# EAGLE design automaton (EAGLE 6.4)

## Sheet 1 of 8: Power
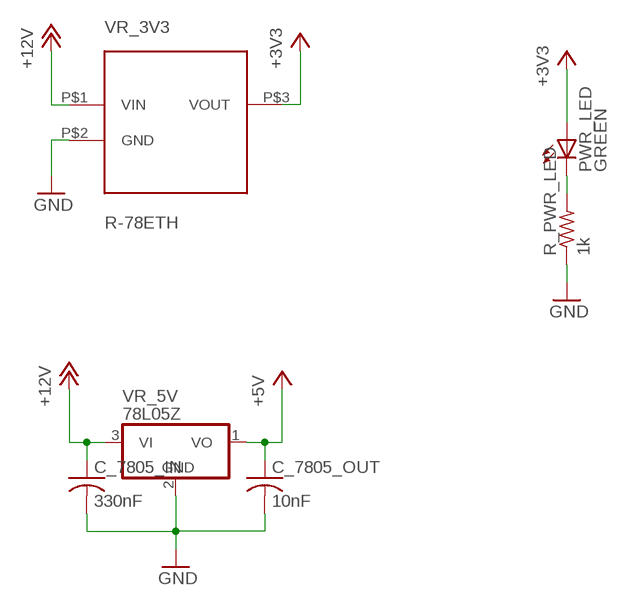
[diagram p0: schematic, sheet 1]

### Parts
C_7805_IN  330nF  C-USC1206  [C1206]
C_7805_OUT  10nF  C-USC1206  [C1206]
PWR_LED  GREEN  LEDCHIPLED_1206  [CHIPLED_1206]
R_PWR_LED  1k  R-US_R1206  [R1206]
VR_3V3  R-78ETH  [R-78E]
VR_5V  78L05Z  [TO92]

### Nets
+3V3 [3v3]: PWR_LED.A VR_3V3.P$3(VOUT) ; also sheet 2,3,4,5,6,7,8
+5V [5v]: C_7805_OUT.1 VR_5V.1(VO) ; also sheet 3
+12V [12v]: C_7805_IN.1 VR_3V3.P$1(VIN) VR_5V.3(VI) ; also sheet 3
GND [gnd]: C_7805_IN.2 C_7805_OUT.2 R_PWR_LED.1 VR_3V3.P$2(GND) VR_5V.2(GND) ; also sheet 2,3,4,5,6,7,8
N$24: PWR_LED.C R_PWR_LED.2

## Sheet 2 of 8: AVR
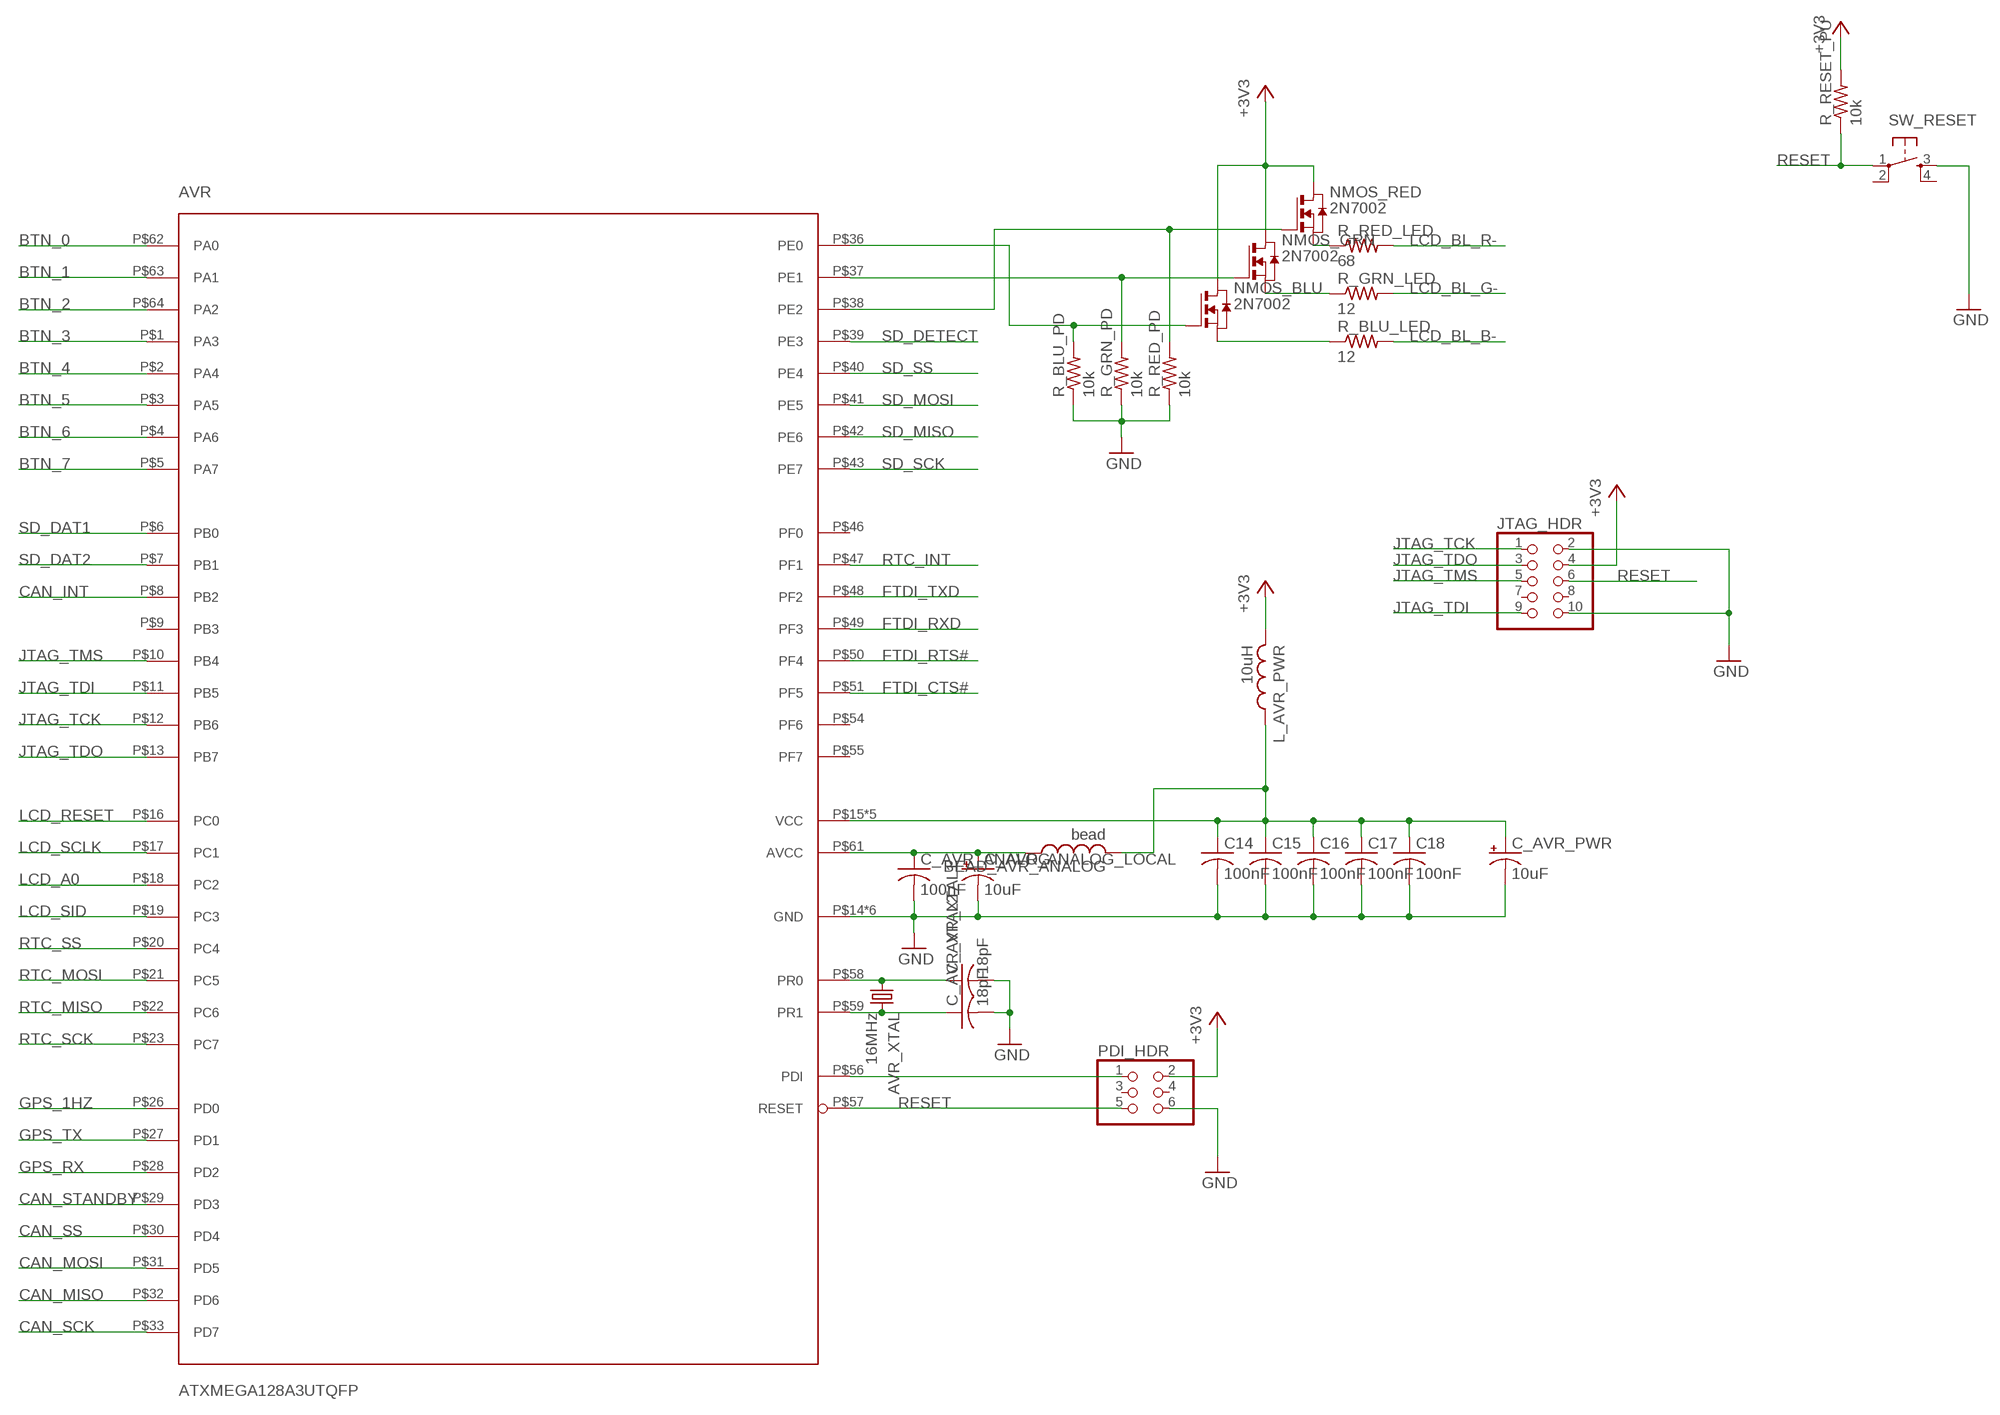
[diagram p1: schematic, sheet 2]

### Parts
AVR  ATXMEGA128A3UTQFP  [ATMEL_TQFP64]
AVR_XTAL  16MHz  CRYSTALHC49S  [HC49/S]
BEAD_AVR_ANALOG  bead  L-USL1812  [L1812]
C14  100nF  C-USC1206  [C1206]
C15  100nF  C-USC1206  [C1206]
C16  100nF  C-USC1206  [C1206]
C17  100nF  C-USC1206  [C1206]
C18  100nF  C-USC1206  [C1206]
C_AVR_ANALOG  100nF  C-USC1206  [C1206]
C_AVR_ANALOG_LOCAL  10uF  CPOL-USE2-5  [E2-5]
C_AVR_PWR  10uF  CPOL-USE2-5  [E2-5]
C_AVR_XTAL1  18pF  C-USC1206  [C1206]
C_AVR_XTAL2  18pF  C-USC1206  [C1206]
JTAG_HDR  PINHD-2X05_2.54  [2X05]
L_AVR_PWR  10uH  L-USL1812  [L1812]
NMOS_BLU  2N7002  NMOSSOT23  [SOT-23]
NMOS_GRN  2N7002  NMOSSOT23  [SOT-23]
NMOS_RED  2N7002  NMOSSOT23  [SOT-23]
PDI_HDR  PINHD-2X03_2.54  [2X03]
R_BLU_LED  12  R-US_R1206  [R1206]
R_BLU_PD  10k  R-US_R1206  [R1206]
R_GRN_LED  12  R-US_R1206  [R1206]
R_GRN_PD  10k  R-US_R1206  [R1206]
R_RED_LED  68  R-US_R1206  [R1206]
R_RED_PD  10k  R-US_R1206  [R1206]
R_RESET_PU  10k  R-US_R1206  [R1206]
SW_RESET  TAC_SWITCHSMD  [TACTILE_SWITCH_SMD]

### Nets
+3V3 [3v3]: JTAG_HDR.4 L_AVR_PWR.2 NMOS_BLU.1(D) NMOS_GRN.1(D) NMOS_RED.1(D) PDI_HDR.2 R_RESET_PU.2 ; also sheet 1,3,4,5,6,7,8
BTN_0: AVR.P$62(PA0) ; also sheet 6
BTN_1: AVR.P$63(PA1) ; also sheet 6
BTN_2: AVR.P$64(PA2) ; also sheet 6
BTN_3: AVR.P$1(PA3) ; also sheet 6
BTN_4: AVR.P$2(PA4) ; also sheet 6
BTN_5: AVR.P$3(PA5) ; also sheet 6
BTN_6: AVR.P$4(PA6) ; also sheet 6
BTN_7: AVR.P$5(PA7) ; also sheet 6
CAN_INT: AVR.P$8(PB2) ; also sheet 3
CAN_MISO: AVR.P$32(PD6) ; also sheet 3
CAN_MOSI: AVR.P$31(PD5) ; also sheet 3
CAN_SCK: AVR.P$33(PD7) ; also sheet 3
CAN_SS: AVR.P$30(PD4) ; also sheet 3
CAN_STANDBY: AVR.P$29(PD3) ; also sheet 3
FTDI_CTS#: AVR.P$51(PF5) ; also sheet 7
FTDI_RTS#: AVR.P$50(PF4) ; also sheet 7
FTDI_RXD: AVR.P$49(PF3) ; also sheet 7
FTDI_TXD: AVR.P$48(PF2) ; also sheet 7
GND [gnd]: AVR.P$14(GND) AVR.P$24(GND) AVR.P$34(GND) AVR.P$44(GND) AVR.P$52(GND) AVR.P$60(GND) C14.2 C15.2 C16.2 C17.2 C18.2 C_AVR_ANALOG.2 C_AVR_ANALOG_LOCAL.- C_AVR_PWR.- C_AVR_XTAL1.2 C_AVR_XTAL2.2 JTAG_HDR.2 JTAG_HDR.10 PDI_HDR.6 R_BLU_PD.1 R_GRN_PD.1 R_RED_PD.1 SW_RESET.3 ; also sheet 1,3,4,5,6,7,8
GPS_1HZ: AVR.P$26(PD0) ; also sheet 4
GPS_RX: AVR.P$28(PD2) ; also sheet 4
GPS_TX: AVR.P$27(PD1) ; also sheet 4
JTAG_TCK: AVR.P$12(PB6) JTAG_HDR.1
JTAG_TDI: AVR.P$11(PB5) JTAG_HDR.9
JTAG_TDO: AVR.P$13(PB7) JTAG_HDR.3
JTAG_TMS: AVR.P$10(PB4) JTAG_HDR.5
LCD_A0: AVR.P$18(PC2) ; also sheet 6
LCD_BL_B-: R_BLU_LED.2 ; also sheet 6
LCD_BL_G-: R_GRN_LED.2 ; also sheet 6
LCD_BL_R-: R_RED_LED.2 ; also sheet 6
LCD_RESET: AVR.P$16(PC0) ; also sheet 6
LCD_SCLK: AVR.P$17(PC1) ; also sheet 6
LCD_SID: AVR.P$19(PC3) ; also sheet 6
N$6: AVR.P$58(PR0) AVR_XTAL.1 C_AVR_XTAL1.1
N$7: AVR.P$59(PR1) AVR_XTAL.2 C_AVR_XTAL2.1
N$18: AVR.P$37(PE1) NMOS_GRN.3(G) R_GRN_PD.2
N$19: AVR.P$36(PE0) NMOS_BLU.3(G) R_BLU_PD.2
N$23 [3v3]: AVR.P$61(AVCC) BEAD_AVR_ANALOG.1 C_AVR_ANALOG.1 C_AVR_ANALOG_LOCAL.+
N$27: AVR.P$38(PE2) NMOS_RED.3(G) R_RED_PD.2
N$28 [3v3]: AVR.P$15(VCC) AVR.P$25(VCC) AVR.P$35(VCC) AVR.P$45(VCC) AVR.P$53(VCC) BEAD_AVR_ANALOG.2 C14.1 C15.1 C16.1 C17.1 C18.1 C_AVR_PWR.+ L_AVR_PWR.1
N$29: NMOS_BLU.2(S) R_BLU_LED.1
N$30: NMOS_GRN.2(S) R_GRN_LED.1
N$31: NMOS_RED.2(S) R_RED_LED.1
PDI_DATA: AVR.P$56(PDI) PDI_HDR.1
RESET: AVR.P$57(RESET) JTAG_HDR.6 PDI_HDR.5 R_RESET_PU.1 SW_RESET.1
RTC_INT: AVR.P$47(PF1) ; also sheet 5
RTC_MISO: AVR.P$22(PC6) ; also sheet 5
RTC_MOSI: AVR.P$21(PC5) ; also sheet 5
RTC_SCK: AVR.P$23(PC7) ; also sheet 5
RTC_SS: AVR.P$20(PC4) ; also sheet 5
SD_DAT1: AVR.P$6(PB0) ; also sheet 8
SD_DAT2: AVR.P$7(PB1) ; also sheet 8
SD_DETECT: AVR.P$39(PE3) ; also sheet 8
SD_MISO: AVR.P$42(PE6) ; also sheet 8
SD_MOSI: AVR.P$41(PE5) ; also sheet 8
SD_SCK: AVR.P$43(PE7) ; also sheet 8
SD_SS: AVR.P$40(PE4) ; also sheet 8
Unconnected: AVR.P$9(PB3) AVR.P$46(PF0) AVR.P$54(PF6) AVR.P$55(PF7) JTAG_HDR.7 JTAG_HDR.8 PDI_HDR.3 PDI_HDR.4 SW_RESET.2 SW_RESET.4

## Sheet 3 of 8: CAN
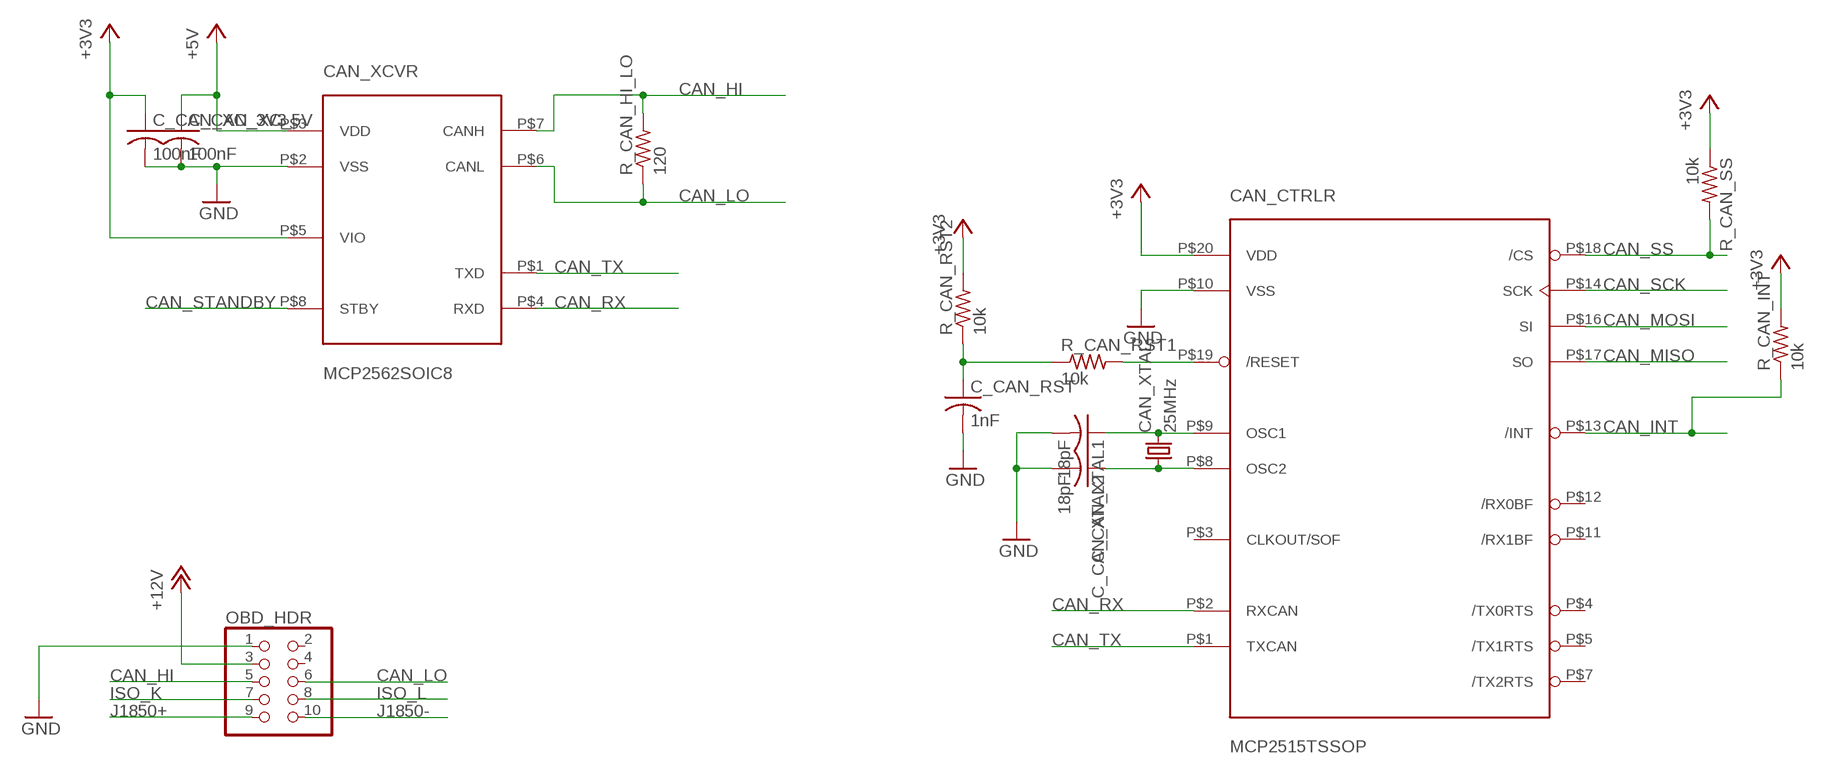
[diagram p2: schematic, sheet 3]

### Parts
C_CAN_RST  1nF  C-USC1206  [C1206]
C_CAN_XC_3V3  100nF  C-USC1206  [C1206]
C_CAN_XC_5V  100nF  C-USC1206  [C1206]
C_CAN_XTAL1  18pF  C-USC1206  [C1206]
C_CAN_XTAL2  18pF  C-USC1206  [C1206]
CAN_CTRLR  MCP2515TSSOP  [MICROCHIP_TSSOP20]
CAN_XCVR  MCP2562SOIC8  [MICROCHIP_SOIC8]
CAN_XTAL  25MHz  CRYSTALHC49S  [HC49/S]
OBD_HDR  PINHD-2X05_2.54-90°  [2X05/90]
R_CAN_HI_LO  120  R-US_R1206  [R1206]
R_CAN_INT  10k  R-US_R1206  [R1206]
R_CAN_RST1  10k  R-US_R1206  [R1206]
R_CAN_RST2  10k  R-US_R1206  [R1206]
R_CAN_SS  10k  R-US_R1206  [R1206]

### Nets
+3V3 [3v3]: C_CAN_XC_3V3.1 CAN_CTRLR.P$20(VDD) CAN_XCVR.P$5(VIO) R_CAN_INT.2 R_CAN_RST2.2 R_CAN_SS.1 ; also sheet 1,2,4,5,6,7,8
+5V [5v]: C_CAN_XC_5V.1 CAN_XCVR.P$3(VDD) ; also sheet 1
+12V [12v]: OBD_HDR.3 ; also sheet 1
CAN_HI: CAN_XCVR.P$7(CANH) OBD_HDR.5 R_CAN_HI_LO.2
CAN_INT: CAN_CTRLR.P$13(/INT) R_CAN_INT.1 ; also sheet 2
CAN_LO: CAN_XCVR.P$6(CANL) OBD_HDR.6 R_CAN_HI_LO.1
CAN_MISO: CAN_CTRLR.P$17(SO) ; also sheet 2
CAN_MOSI: CAN_CTRLR.P$16(SI) ; also sheet 2
CAN_RX: CAN_CTRLR.P$2(RXCAN) CAN_XCVR.P$4(RXD)
CAN_SCK: CAN_CTRLR.P$14(SCK) ; also sheet 2
CAN_SS: CAN_CTRLR.P$18(/CS) R_CAN_SS.2 ; also sheet 2
CAN_STANDBY: CAN_XCVR.P$8(STBY) ; also sheet 2
CAN_TX: CAN_CTRLR.P$1(TXCAN) CAN_XCVR.P$1(TXD)
GND [gnd]: C_CAN_RST.2 C_CAN_XC_3V3.2 C_CAN_XC_5V.2 C_CAN_XTAL1.2 C_CAN_XTAL2.2 CAN_CTRLR.P$10(VSS) CAN_XCVR.P$2(VSS) OBD_HDR.1 ; also sheet 1,2,4,5,6,7,8
ISO_K: OBD_HDR.7
ISO_L: OBD_HDR.8
J1850+: OBD_HDR.9
J1850-: OBD_HDR.10
N$5: C_CAN_RST.1 R_CAN_RST1.1 R_CAN_RST2.1
N$20: C_CAN_XTAL1.1 CAN_CTRLR.P$9(OSC1) CAN_XTAL.2
N$21: C_CAN_XTAL2.1 CAN_CTRLR.P$8(OSC2) CAN_XTAL.1
N$22: CAN_CTRLR.P$19(/RESET) R_CAN_RST1.2
Unconnected: CAN_CTRLR.P$3(CLKOUT/SOF) CAN_CTRLR.P$4(/TX0RTS) CAN_CTRLR.P$5(/TX1RTS) CAN_CTRLR.P$7(/TX2RTS) CAN_CTRLR.P$11(/RX1BF) CAN_CTRLR.P$12(/RX0BF) OBD_HDR.2 OBD_HDR.4

## Sheet 4 of 8: GPS
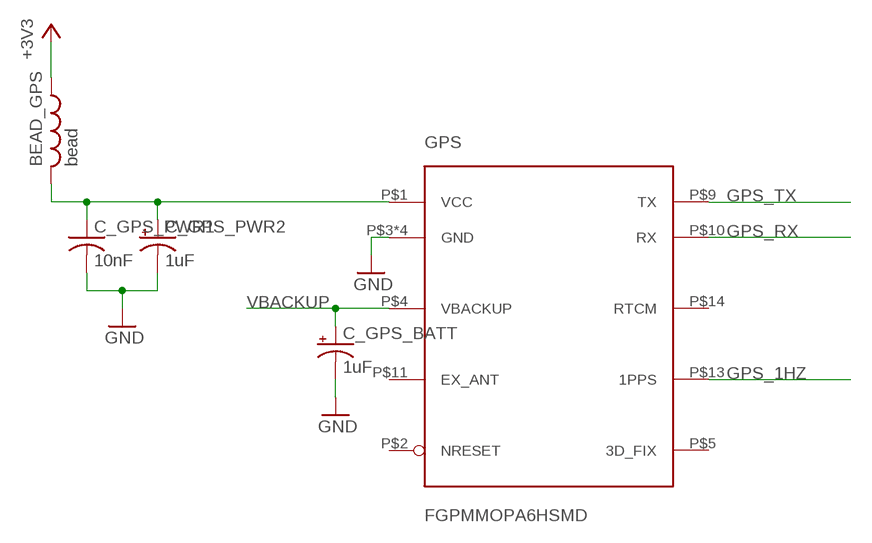
[diagram p3: schematic, sheet 4]

### Parts
BEAD_GPS  bead  L-USL1812  [L1812]
C_GPS_BATT  1uF  CPOL-USE2-5  [E2-5]
C_GPS_PWR1  10nF  C-USC1206  [C1206]
C_GPS_PWR2  1uF  CPOL-USE2-5  [E2-5]
GPS  FGPMMOPA6HSMD  [FGPMMOPA6H]

### Nets
+3V3 [3v3]: BEAD_GPS.1 ; also sheet 1,2,3,5,6,7,8
GND [gnd]: C_GPS_BATT.- C_GPS_PWR1.2 C_GPS_PWR2.- GPS.P$3(GND) GPS.P$8(GND) GPS.P$12(GND) GPS.P$19(GND) ; also sheet 1,2,3,5,6,7,8
GPS_1HZ: GPS.P$13(1PPS) ; also sheet 2
GPS_RX: GPS.P$10(RX) ; also sheet 2
GPS_TX: GPS.P$9(TX) ; also sheet 2
N$1 [3v3]: BEAD_GPS.2 C_GPS_PWR1.1 C_GPS_PWR2.+ GPS.P$1(VCC)
VBACKUP [vbatt]: C_GPS_BATT.+ GPS.P$4(VBACKUP) ; also sheet 5
Unconnected: GPS.P$2(NRESET) GPS.P$5(3D_FIX) GPS.P$11(EX_ANT) GPS.P$14(RTCM)

## Sheet 5 of 8: RTC
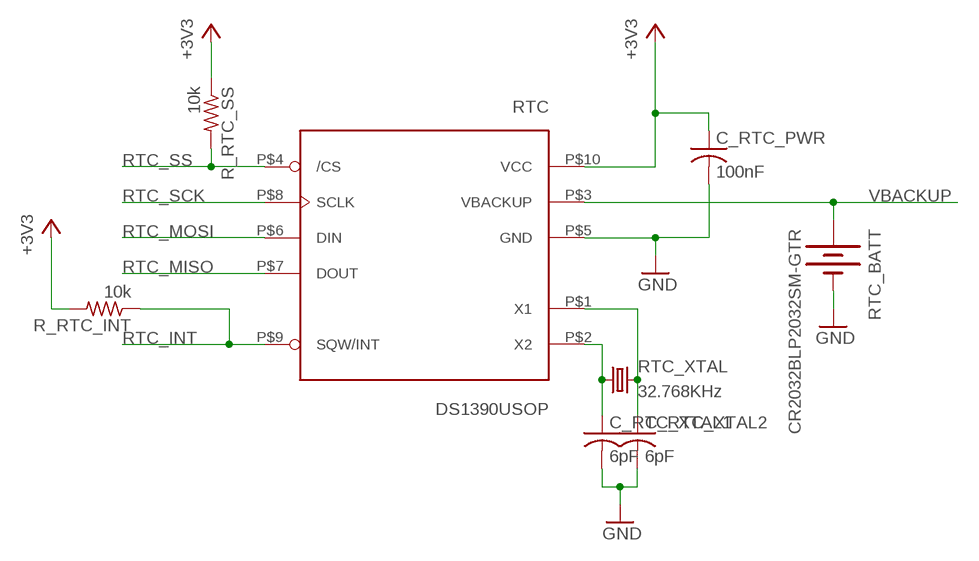
[diagram p4: schematic, sheet 5]

### Parts
C_RTC_PWR  100nF  C-USC1206  [C1206]
C_RTC_XTAL1  6pF  C-USC1206  [C1206]
C_RTC_XTAL2  6pF  C-USC1206  [C1206]
R_RTC_INT  10k  R-US_R1206  [R1206]
R_RTC_SS  10k  R-US_R1206  [R1206]
RTC  DS1390USOP  [MAXIM_10USOP]
RTC_BATT  CR2032BLP2032SM-GTR  [BLP2032SM-GTR]
RTC_XTAL  32.768KHz  CRYSTALTC26V  [TC26V]

### Nets
+3V3 [3v3]: C_RTC_PWR.1 R_RTC_INT.2 R_RTC_SS.1 RTC.P$10(VCC) ; also sheet 1,2,3,4,6,7,8
GND [gnd]: C_RTC_PWR.2 C_RTC_XTAL1.2 C_RTC_XTAL2.2 RTC.P$5(GND) RTC_BATT.P$2(-) ; also sheet 1,2,3,4,6,7,8
N$2: C_RTC_XTAL1.1 RTC.P$2(X2) RTC_XTAL.1
N$3: C_RTC_XTAL2.1 RTC.P$1(X1) RTC_XTAL.2
RTC_INT: R_RTC_INT.1 RTC.P$9(SQW/INT) ; also sheet 2
RTC_MISO: RTC.P$7(DOUT) ; also sheet 2
RTC_MOSI: RTC.P$6(DIN) ; also sheet 2
RTC_SCK: RTC.P$8(SCLK) ; also sheet 2
RTC_SS: R_RTC_SS.2 RTC.P$4(/CS) ; also sheet 2
VBACKUP [vbatt]: RTC.P$3(VBACKUP) RTC_BATT.P$1(+) ; also sheet 4

## Sheet 6 of 8: Front Panel
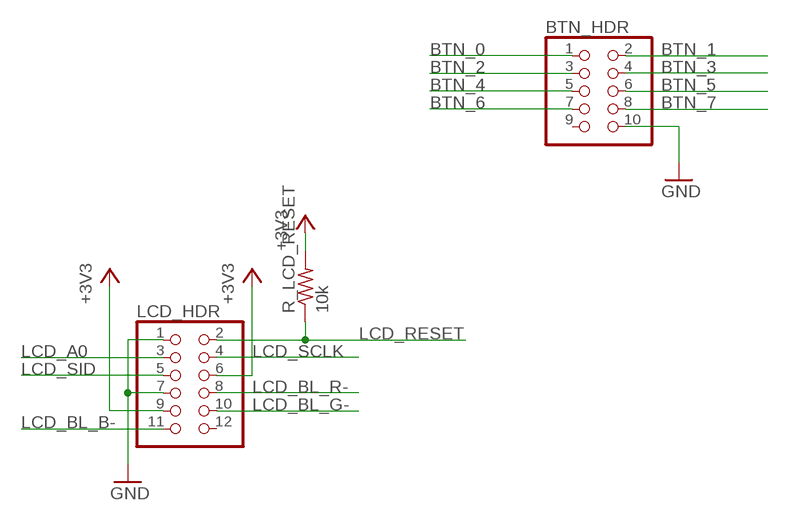
[diagram p5: schematic, sheet 6]

### Parts
BTN_HDR  PINHD-2X05_2.54  [2X05]
LCD_HDR  PINHD-2X06_2.54  [2X06]
R_LCD_RESET  10k  R-US_R1206  [R1206]

### Nets
+3V3 [3v3]: LCD_HDR.6 LCD_HDR.9 R_LCD_RESET.2 ; also sheet 1,2,3,4,5,7,8
BTN_0: BTN_HDR.1 ; also sheet 2
BTN_1: BTN_HDR.2 ; also sheet 2
BTN_2: BTN_HDR.3 ; also sheet 2
BTN_3: BTN_HDR.4 ; also sheet 2
BTN_4: BTN_HDR.5 ; also sheet 2
BTN_5: BTN_HDR.6 ; also sheet 2
BTN_6: BTN_HDR.7 ; also sheet 2
BTN_7: BTN_HDR.8 ; also sheet 2
GND [gnd]: BTN_HDR.10 LCD_HDR.1 LCD_HDR.7 ; also sheet 1,2,3,4,5,7,8
LCD_A0: LCD_HDR.3 ; also sheet 2
LCD_BL_B-: LCD_HDR.11 ; also sheet 2
LCD_BL_G-: LCD_HDR.10 ; also sheet 2
LCD_BL_R-: LCD_HDR.8 ; also sheet 2
LCD_RESET: LCD_HDR.2 R_LCD_RESET.1 ; also sheet 2
LCD_SCLK: LCD_HDR.4 ; also sheet 2
LCD_SID: LCD_HDR.5 ; also sheet 2
Unconnected: BTN_HDR.9 LCD_HDR.12

## Sheet 7 of 8: USB
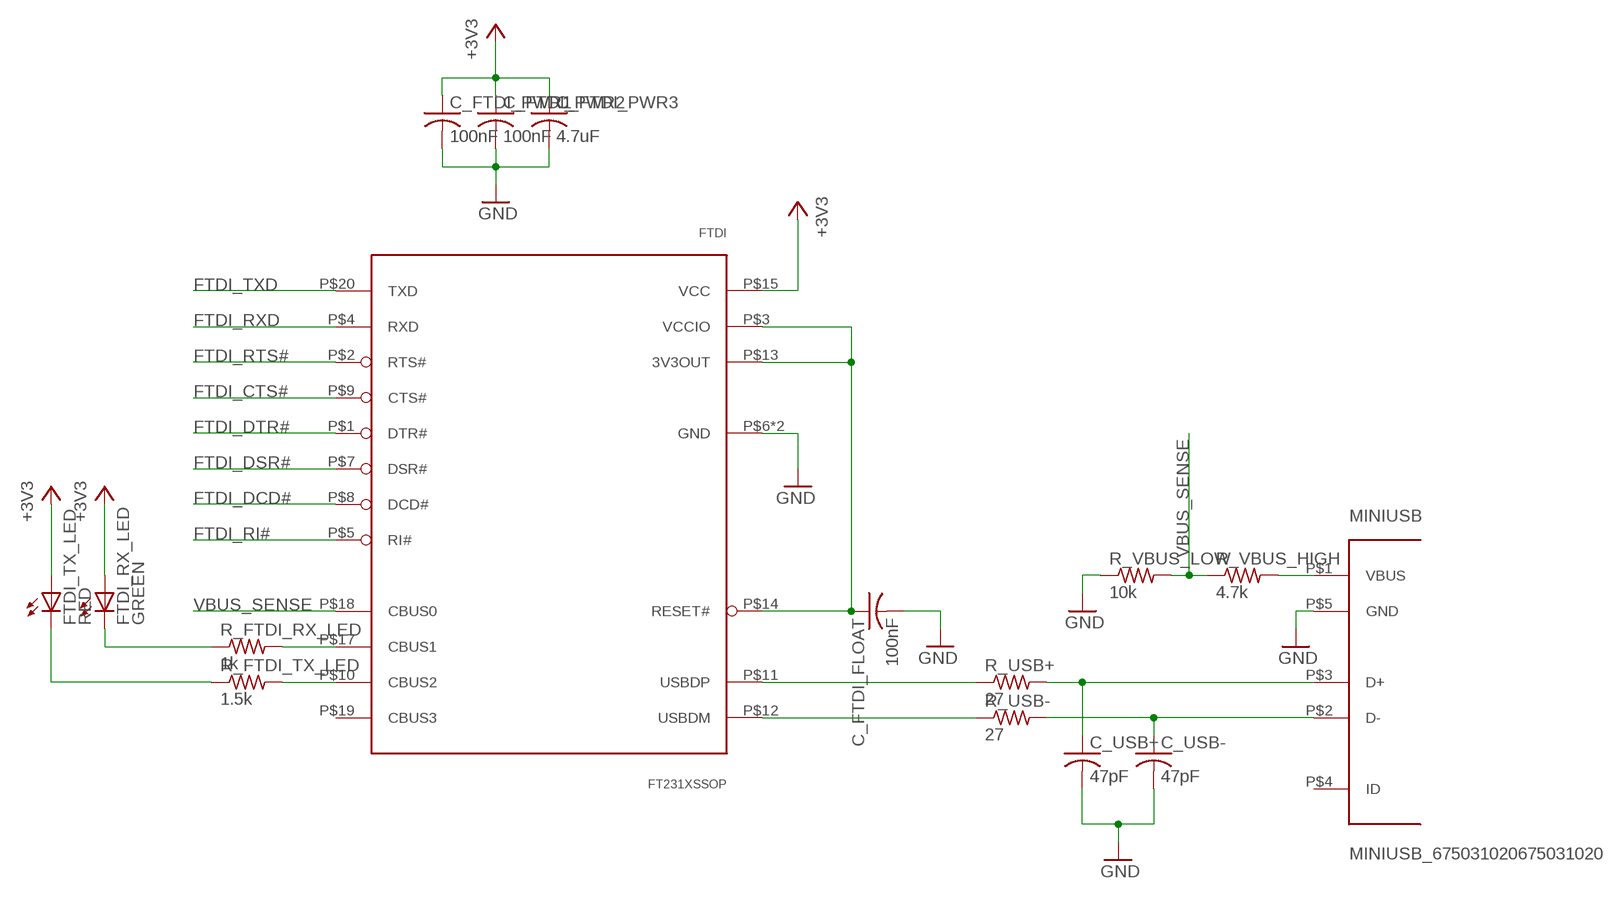
[diagram p6: schematic, sheet 7]

### Parts
C_FTDI_FLOAT  100nF  C-USC1206  [C1206]
C_FTDI_PWR1  100nF  C-USC1206  [C1206]
C_FTDI_PWR2  100nF  C-USC1206  [C1206]
C_FTDI_PWR3  4.7uF  C-USC1206  [C1206]
C_USB+  47pF  C-USC1206  [C1206]
C_USB-  47pF  C-USC1206  [C1206]
FTDI  FT231XSSOP  [FTDI_SSOP20]
FTDI_RX_LED  GREEN  LEDCHIPLED_1206  [CHIPLED_1206]
FTDI_TX_LED  RED  LEDCHIPLED_1206  [CHIPLED_1206]
MINIUSB  MINIUSB_675031020675031020  [MINIUSB_675031020]
R_FTDI_RX_LED  1k  R-US_R1206  [R1206]
R_FTDI_TX_LED  1.5k  R-US_R1206  [R1206]
R_USB+  27  R-US_R1206  [R1206]
R_USB-  27  R-US_R1206  [R1206]
R_VBUS_HIGH  4.7k  R-US_R1206  [R1206]
R_VBUS_LOW  10k  R-US_R1206  [R1206]

### Nets
+3V3 [3v3]: C_FTDI_PWR1.1 C_FTDI_PWR2.1 C_FTDI_PWR3.1 FTDI.P$15(VCC) FTDI_RX_LED.A FTDI_TX_LED.A ; also sheet 1,2,3,4,5,6,8
FTDI_CTS#: FTDI.P$9(CTS#) ; also sheet 2
FTDI_DCD#: FTDI.P$8(DCD#)
FTDI_DSR#: FTDI.P$7(DSR#)
FTDI_DTR#: FTDI.P$1(DTR#)
FTDI_RI#: FTDI.P$5(RI#)
FTDI_RTS#: FTDI.P$2(RTS#) ; also sheet 2
FTDI_RXD: FTDI.P$4(RXD) ; also sheet 2
FTDI_TXD: FTDI.P$20(TXD) ; also sheet 2
GND [gnd]: C_FTDI_FLOAT.2 C_FTDI_PWR1.2 C_FTDI_PWR2.2 C_FTDI_PWR3.2 C_USB+.2 C_USB-.2 FTDI.P$6(GND) FTDI.P$16(GND) MINIUSB.P$5(GND) R_VBUS_LOW.1 ; also sheet 1,2,3,4,5,6,8
N$4: C_FTDI_FLOAT.1 FTDI.P$3(VCCIO) FTDI.P$13(3V3OUT) FTDI.P$14(RESET#)
N$8: FTDI_RX_LED.C R_FTDI_RX_LED.1
N$9: FTDI.P$12(USBDM) R_USB-.1
N$10: FTDI.P$11(USBDP) R_USB+.1
N$11: FTDI_TX_LED.C R_FTDI_TX_LED.1
N$12: FTDI.P$10(CBUS2) R_FTDI_TX_LED.2
N$13: FTDI.P$17(CBUS1) R_FTDI_RX_LED.2
N$14: C_USB+.1 MINIUSB.P$3(D+) R_USB+.2
N$15: C_USB-.1 MINIUSB.P$2(D-) R_USB-.2
N$17: MINIUSB.P$1(VBUS) R_VBUS_HIGH.2
VBUS_SENSE: FTDI.P$18(CBUS0) R_VBUS_HIGH.1 R_VBUS_LOW.2
Unconnected: FTDI.P$19(CBUS3) MINIUSB.P$4(ID)

## Sheet 8 of 8: MicroSD
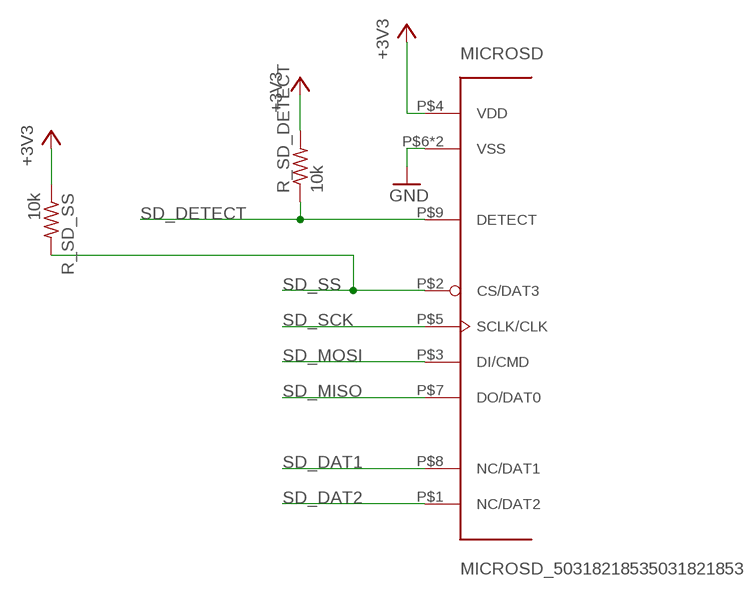
[diagram p7: schematic, sheet 8]

### Parts
MICROSD  MICROSD_50318218535031821853  [MICROSD_5031821853]
R_SD_DETECT  10k  R-US_R1206  [R1206]
R_SD_SS  10k  R-US_R1206  [R1206]

### Nets
+3V3 [3v3]: MICROSD.P$4(VDD) R_SD_DETECT.2 R_SD_SS.1 ; also sheet 1,2,3,4,5,6,7
GND [gnd]: MICROSD.P$6(VSS) MICROSD.P$10(VSS) ; also sheet 1,2,3,4,5,6,7
SD_DAT1: MICROSD.P$8(NC/DAT1) ; also sheet 2
SD_DAT2: MICROSD.P$1(NC/DAT2) ; also sheet 2
SD_DETECT: MICROSD.P$9(DETECT) R_SD_DETECT.1 ; also sheet 2
SD_MISO: MICROSD.P$7(DO/DAT0) ; also sheet 2
SD_MOSI: MICROSD.P$3(DI/CMD) ; also sheet 2
SD_SCK: MICROSD.P$5(SCLK/CLK) ; also sheet 2
SD_SS: MICROSD.P$2(CS/DAT3) R_SD_SS.2 ; also sheet 2

## Library data of the parts
AVR = automaton:ATXMEGA128A3U
AVR_XTAL CAN_XTAL = crystal:CRYSTAL: CRYSTAL; OC_FARNELL: 1667008; OC_NEWARK: unknown
BEAD_AVR_ANALOG BEAD_GPS L_AVR_PWR = rcl:L-US: INDUCTOR, American symbol
BTN_HDR JTAG_HDR OBD_HDR = pinhead-2:PINHD-2X05: PIN HEADER
C14-C18 C_7805_IN C_7805_OUT C_AVR_ANALOG C_AVR_XTAL1 C_AVR_XTAL2 C_CAN_RST C_CAN_XC_3V3 C_CAN_XC_5V C_CAN_XTAL1 C_CAN_XTAL2 C_FTDI_FLOAT C_FTDI_PWR1-C_FTDI_PWR3 C_GPS_PWR1 C_RTC_PWR C_RTC_XTAL1 C_RTC_XTAL2 C_USB+ C_USB- = rcl:C-US: CAPACITOR, American symbol
C_AVR_ANALOG_LOCAL C_AVR_PWR C_GPS_BATT C_GPS_PWR2 = rcl:CPOL-US: POLARIZED CAPACITOR, American symbol
CAN_CTRLR = automaton:MCP2515
CAN_XCVR = automaton:MCP2562
FTDI = automaton:FT231X
FTDI_RX_LED FTDI_TX_LED PWR_LED = led:LED: LED OSRAM: - CHIPLED LG R971, LG N971, LY N971, LG Q971, LY Q971, LO R971, LY R971 LH N974, LH R974 LS Q976, LO Q976, LY Q976 LO Q996 - Hyper CHIPLED LW Q18S LB Q993, LB Q99A, LB R99A - SideLED LS A670, LO A670, LY A670, LG A670, LP A670 LB A673, LV A673, LT A673, LW A673 LH A674 LY A675 LS A676, LA A676, LO A676, LY A676, LW A676 LS A679, LY A679, LG A679 - Hyper Micro SIDELED® LS Y876, LA Y876, LO Y876, LY Y876 LT Y87S - SmartLED LW L88C, LW L88S LB L89C, LB L89S, LG L890 LS L89K, LO L89K, LY L89K LS L896, LA L896, LO L896, LY L896 - TOPLED LS T670, LO T670, LY T670, LG T670, LP T670 LSG T670, LSP T670, LSY T670, LOP T670, LYG T670 LG T671, LOG T671, LSG T671 LB T673, LV T673, LT T673, LW T673 LH T674 LS T676, LA T676, LO T676, LY T676, LB T676, LH T676, LSB T676, LW T676 LB T67C, LV T67C, LT T67C, LS T67K, LO T67K, LY T67K, LW E67C LS E67B, LA E67B, LO E67B, LY E67B, LB E67C, LV E67C, LT E67C LW T67C LS T679, LY T679, LG T679 LS T770, LO T770, LY T770, LG T770, LP T770 LB T773, LV T773, LT T773, LW T773 LH T774 LS E675, LA E675, LY E675, LS T675 LS T776, LA T776, LO T776, LY T776, LB T776 LHGB T686 LT T68C, LB T68C - Hyper Mini TOPLED® LB M676 - Mini TOPLED Santana® LG M470 LS M47K, LO M47K, LY M47K Source: http://www.osram.convergy.de LUXEON: - LUMILED® LXK2-PW12-R00, LXK2-PW12-S00, LXK2-PW14-U00, LXK2-PW14-V00 LXK2-PM12-R00, LXK2-PM12-S00, LXK2-PM14-U00 LXK2-PE12-Q00, LXK2-PE12-R00, LXK2-PE12-S00, LXK2-PE14-T00, LXK2-PE14-U00 LXK2-PB12-K00, LXK2-PB12-L00, LXK2-PB12-M00, LXK2-PB14-N00, LXK2-PB14-P00, LXK2-PB14-Q00 LXK2-PR12-L00, LXK2-PR12-M00, LXK2-PR14-Q00, LXK2-PR14-R00 LXK2-PD12-Q00, LXK2-PD12-R00, LXK2-PD12-S00 LXK2-PH12-R00, LXK2-PH12-S00 LXK2-PL12-P00, LXK2-PL12-Q00, LXK2-PL12-R00 Source: www.luxeon.com KINGBRIGHT: KA-3528ASYC Source: www.kingbright.com
GPS = automaton:FGPMMOPA6H
LCD_HDR = pinhead-2:PINHD-2X06: PIN HEADER
MICROSD = automaton:MICROSD_5031821853
MINIUSB = automaton:MINIUSB_675031020
NMOS_BLU NMOS_GRN NMOS_RED = zetex:NMOSSOT23: MOS FET; OC_FARNELL: unknown; OC_NEWARK: unknown
PDI_HDR = pinhead-2:PINHD-2X03: PIN HEADER
R_BLU_LED R_BLU_PD R_CAN_HI_LO R_CAN_INT R_CAN_RST1 R_CAN_RST2 R_CAN_SS R_FTDI_RX_LED R_FTDI_TX_LED R_GRN_LED R_GRN_PD R_LCD_RESET R_PWR_LED R_RED_LED R_RED_PD R_RESET_PU R_RTC_INT R_RTC_SS R_SD_DETECT R_SD_SS R_USB+ R_USB- R_VBUS_HIGH R_VBUS_LOW = rcl:R-US_: RESISTOR, American symbol
RTC = automaton:DS1390
RTC_BATT = automaton:CR2032
RTC_XTAL = crystal:CRYSTAL: CRYSTAL; OC_FARNELL: unknown; OC_NEWARK: unknown
SW_RESET = SparkFun:TAC_SWITCH: Momentary Switch Button commonly used for reset or general input. Spark Fun Electronics SKU : COM-00097
VR_3V3 = automaton:R-78E
VR_5V = linear:78*: Positive VOLTAGE REGULATOR Source: http://cache.national.com/ds/LM/LM78L05.pdf http://www.fairchildsemi.com/ds/LM/LM7805.pdf

## Net classes
0 default: width 0.2 mm, clearance 0.2 mm
1 gnd: width 0.3 mm, clearance 0.2 mm
2 12v: width 0.6 mm, clearance 0.4 mm
3 3v3: width 0.3 mm, clearance 0.2 mm
4 vbatt: width 0.2 mm, clearance 0.2 mm
5 5v: width 0.3 mm, clearance 0.2 mm

## Board
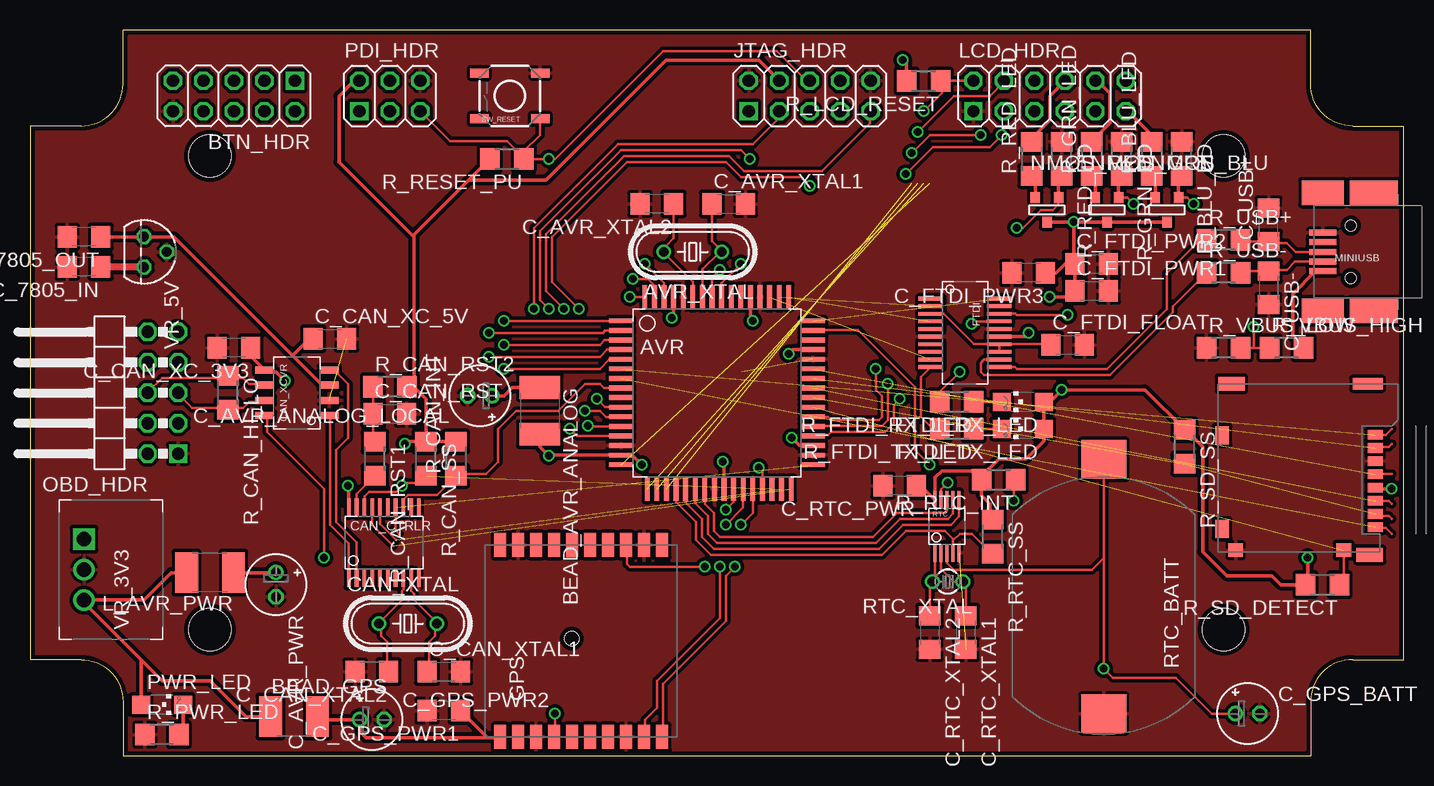
[diagram p8: board, top side]
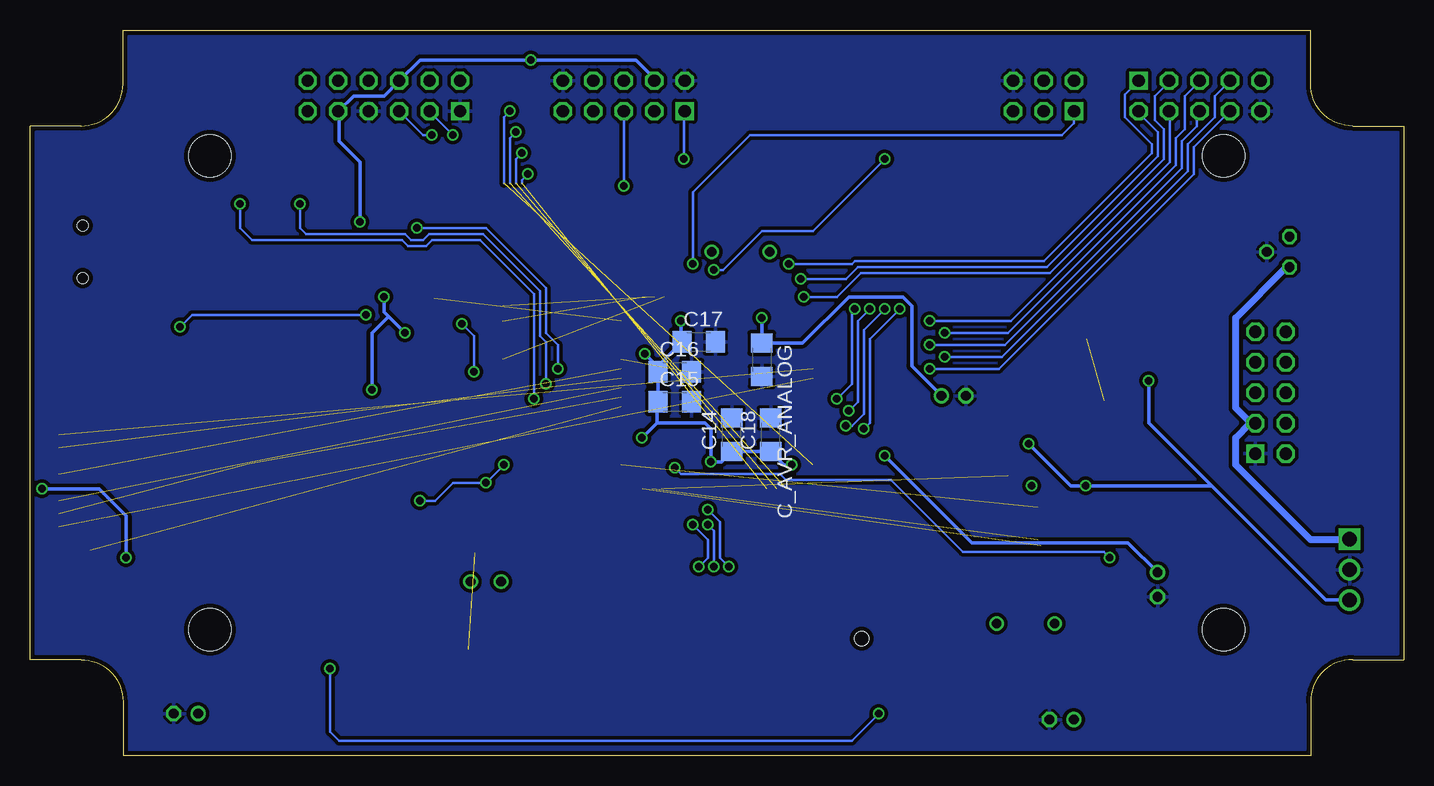
[diagram p9: board, bottom side, seen from below]

Size 114.5 x 60.5 mm. Coordinates in mm from the lower left corner, seen from the top.
Outline: 4.25,8 arc-90 7.75,4.5 7.75,0 106.75,0 106.75,4.5 arc-90 110.25,8 114.5,8 114.5,52.5 110.25,52.5 arc-90 106.75,56 106.75,60.5 7.75,60.5 7.75,56 arc-90 4.25,52.5 0,52.5 0,8 4.25,8
Copper layers (1*16): Top 0.0356mm / dielectric 1.5011mm / Bottom 0.0356mm
Design rules "LaenPCBOrder": minimum track width 6mil, minimum drill 13mil, track to track 6mil, track to pad 6mil, pad to pad 6mil, via to via 6mil, smd to smd 6mil, copper to edge 15mil, drill to drill 6mil, minimum pad ring 7mil, minimum via ring 7mil, stop-mask expansion 3mil, vias tented up to drill 0mil, thermal gap 10mil
Holes 3.5 mm at 15,10.5 99.5,10.5 15,50 99.5,50

### Footprints (pad centres in the part's own frame; a part is rotated, then mirrored left to right if it is on the bottom)
ATMEL_TQFP64 = smd 2 x 0.4: P$1 -8,6; P$2 -8,5.2; P$3 -8,4.4; P$4 -8,3.6; P$5 -8,2.8; P$6 -8,2; P$7 -8,1.2; P$8 -8,0.4; P$9 -8,-0.4; P$10 -8,-1.2; P$11 -8,-2; P$12 -8,-2.8; P$13 -8,-3.6; P$14 -8,-4.4; P$15 -8,-5.2; P$16 -8,-6; P$33 8,-6; P$34 8,-5.2; P$35 8,-4.4; P$36 8,-3.6; P$37 8,-2.8; P$38 8,-2; P$39 8,-1.2; P$40 8,-0.4; P$41 8,0.4; P$42 8,1.2; P$43 8,2; P$44 8,2.8; P$45 8,3.6; P$46 8,4.4; P$47 8,5.2; P$48 8,6 | smd 0.4 x 2: P$17 -5.8,-8; P$18 -5,-8; P$19 -4.2,-8; P$20 -3.4,-8; P$21 -2.6,-8; P$22 -1.8,-8; P$23 -1,-8; P$24 -0.2,-8; P$25 0.6,-8; P$26 1.4,-8; P$27 2.2,-8; P$28 3,-8; P$29 3.8,-8; P$30 4.6,-8; P$31 5.4,-8; P$32 6.2,-8; P$49 6,8; P$50 5.2,8; P$51 4.4,8; P$52 3.6,8; P$53 2.8,8; P$54 2,8; P$55 1.2,8; P$56 0.4,8; P$57 -0.4,8; P$58 -1.2,8; P$59 -2,8; P$60 -2.8,8; P$61 -3.6,8; P$62 -4.4,8; P$63 -5.2,8; P$64 -6,8
HC49/S = drill 0.813: 1 -2.413,0; 2 2.413,0
L1812 = smd 1.9 x 3.4: 1 -1.95,0; 2 1.95,0
2X05 = drill 1.016 square: 1 -5.08,-1.27 | drill 1.016 octagon: 2 -5.08,1.27; 3 -2.54,-1.27; 4 -2.54,1.27; 5 0,-1.27; 6 0,1.27; 7 2.54,-1.27; 8 2.54,1.27; 9 5.08,-1.27; 10 5.08,1.27
C1206 = smd 1.6 x 1.8: 1 -1.4,0; 2 1.4,0
E2-5 = drill 0.813 pad 1.27: + -1.016,0 | drill 0.813 pad 1.27 octagon: - 1.016,0
MICROCHIP_TSSOP20 = smd 0.3 x 1.5: P$1 -2.925,-2.95; P$2 -2.275,-2.95; P$3 -1.625,-2.95; P$4 -0.975,-2.95; P$5 -0.325,-2.95; P$6 0.325,-2.95; P$7 0.975,-2.95; P$8 1.625,-2.95; P$9 2.275,-2.95; P$10 2.925,-2.95; P$11 2.925,2.95; P$12 2.275,2.95; P$13 1.625,2.95; P$14 0.975,2.95; P$15 0.325,2.95; P$16 -0.325,2.95; P$17 -0.975,2.95; P$18 -1.625,2.95; P$19 -2.275,2.95; P$20 -2.925,2.95
MICROCHIP_SOIC8 = smd 0.6 x 1.55: P$1 -1.905,-2.7; P$2 -0.635,-2.7; P$3 0.635,-2.7; P$4 1.905,-2.7; P$5 1.905,2.7; P$6 0.635,2.7; P$7 -0.635,2.7; P$8 -1.905,2.7
FTDI_SSOP20 = smd 0.318 x 2.032: P$1 -2.857,-2.857; P$2 -2.223,-2.857; P$3 -1.587,-2.857; P$4 -0.953,-2.857; P$5 -0.318,-2.857; P$6 0.318,-2.857; P$7 0.953,-2.857; P$8 1.587,-2.857; P$9 2.223,-2.857; P$10 2.857,-2.857; P$11 2.857,2.857; P$12 2.223,2.857; P$13 1.587,2.857; P$14 0.953,2.857; P$15 0.318,2.857; P$16 -0.318,2.857; P$17 -0.953,2.857; P$18 -1.587,2.857; P$19 -2.223,2.857; P$20 -2.857,2.857
CHIPLED_1206 = smd 1.5 x 1.5: A 0,-1.75; C 0,1.75
FGPMMOPA6H = smd 2 x 1: P$1 -8,6.75; P$2 -8,5.25; P$3 -8,3.75; P$4 -8,2.25; P$5 -8,0.75; P$6 -8,-0.75; P$7 -8,-2.25; P$8 -8,-3.75; P$9 -8,-5.25; P$10 -8,-6.75; P$11 8,-6.75; P$12 8,-5.25; P$13 8,-3.75; P$14 8,-2.25; P$15 8,-0.75; P$16 8,0.75; P$17 8,2.25; P$18 8,3.75; P$19 8,5.25; P$20 8,6.75 | hole 1.2: 0.2,0.8
2X06 = drill 1.016 square: 1 -6.35,-1.27 | drill 1.016 octagon: 2 -6.35,1.27; 3 -3.81,-1.27; 4 -3.81,1.27; 5 -1.27,-1.27; 6 -1.27,1.27; 7 1.27,-1.27; 8 1.27,1.27; 9 3.81,-1.27; 10 3.81,1.27; 11 6.35,-1.27; 12 6.35,1.27
MICROSD_5031821853 = smd 0.8 x 1.25: P$1 4.95,5.625; P$2 3.85,5.625; P$3 2.75,5.625; P$4 1.65,5.625; P$5 0.55,5.625; P$6 -0.55,5.625; P$7 -1.65,5.625; P$8 -2.75,5.625 | smd 1.15 x 1.25: P$9 6.875,3 | smd 1.15 x 1.2: P$10 6.875,-6 | smd 0.95 x 2.5: P$11 -7,5 | smd 1.15 x 2.2: P$12 -7,-6.35; P$13 7.275,5.175 | smd 1.5 x 1.15: P$14 -2.7,-7.125; P$15 5.1,-7.125
MINIUSB_675031020 = smd 2.25 x 0.5: P$1 3.75,1.6; P$2 3.75,0.8; P$3 3.75,0; P$4 3.75,-0.8; P$5 3.75,-1.6 | smd 4 x 2.05: P$6 -0.5,-4.925; P$7 -0.5,4.925 | smd 3.5 x 2.05: P$8 3.75,-4.925; P$9 3.75,4.925 | hole 0.9: 1.4,2.2; 1.4,-2.2
SOT-23 = smd 0.787 x 0.889: 1 0.025,-1.016; 2 -0.94,1.016; 3 0.991,1.016
2X05/90 = drill 1.016 square: 1 -5.08,-6.35 | drill 1.016 octagon: 2 -5.08,-3.81; 3 -2.54,-6.35; 4 -2.54,-3.81; 5 0,-6.35; 6 0,-3.81; 7 2.54,-6.35; 8 2.54,-3.81; 9 5.08,-6.35; 10 5.08,-3.81
2X03 = drill 1.016 square: 1 -2.54,-1.27 | drill 1.016 octagon: 2 -2.54,1.27; 3 0,-1.27; 4 0,1.27; 5 2.54,-1.27; 6 2.54,1.27
R1206 = smd 1.6 x 1.803: 1 -1.422,0; 2 1.422,0
MAXIM_10USOP = smd 0.25 x 1.5: P$1 -1,-2.2; P$2 -0.5,-2.2; P$3 0,-2.2; P$4 0.5,-2.2; P$5 1,-2.2; P$6 1,2.2; P$7 0.5,2.2; P$8 0,2.2; P$9 -0.5,2.2; P$10 -1,2.2
BLP2032SM-GTR = smd 3.2 x 3.75: P$1 -12.2,0; P$2 9,0
TC26V = drill 0.813: 1 -1.27,0; 2 1.27,0
TACTILE_SWITCH_SMD = smd 1.524 x 0.762: 1 -2.54,1.905; 2 2.54,1.905; 3 -2.54,-1.905; 4 2.54,-1.905
R-78E = drill 1.2 square: P$1 2.54,2.25 | drill 1.2: P$2 0,2.25; P$3 -2.54,2.25
TO92 = drill 0.813 octagon: 1 -1.27,0; 2 0,1.905; 3 1.27,0

### Placement (x,y rotation side)
AVR  57.25,30.25 0 top
AVR_XTAL  55.25,42 180 top
BEAD_AVR_ANALOG  42.5,28.75 270 top
BEAD_GPS  22,3.25 0 top
BTN_HDR  17,55 180 top
C14  56,26.75 90 bottom
C15  60.75,29.5 0 bottom
C16  60.75,32 0 bottom
C17  58.75,34.5 0 bottom
C18  52.75,26.75 90 bottom
C_7805_IN  4.5,40.75 180 top
C_7805_OUT  4.5,43.25 180 top
C_AVR_ANALOG  53.5,33 270 bottom
C_AVR_ANALOG_LOCAL  37.5,30 180 top
C_AVR_PWR  20.5,14.25 270 top
C_AVR_XTAL1  58.25,46 0 top
C_AVR_XTAL2  52.25,46 180 top
C_CAN_RST  30,28.5 0 top
C_CAN_XC_3V3  17,34 180 top
C_CAN_XC_5V  25,34.75 0 top
C_CAN_XTAL1  34.5,7 0 top
C_CAN_XTAL2  28.5,7 180 top
C_FTDI_FLOAT  86.5,34.25 0 top
C_FTDI_PWR1  88.5,38.75 0 top
C_FTDI_PWR2  88.5,41 0 top
C_FTDI_PWR3  83.25,40.25 180 top
C_GPS_BATT  101.5,3.5 0 top
C_GPS_PWR1  34.5,3.75 180 top
C_GPS_PWR2  28.5,3 0 top
C_RTC_PWR  72.5,22.5 180 top
C_RTC_XTAL1  78,10.25 270 top
C_RTC_XTAL2  75,10.25 270 top
C_USB+  103.25,44.25 90 top
C_USB-  103.25,39 270 top
CAN_CTRLR  29.5,17.75 0 top
CAN_XCVR  22.25,30.25 90 top
CAN_XTAL  31.5,11 0 top
FTDI  77.95,35.25 270 top
FTDI_RX_LED  82.75,29.5 90 top
FTDI_TX_LED  82.75,27.25 90 top
GPS  45.95,9.55 90 top
JTAG_HDR  65,55 0 top
L_AVR_PWR  15,15.25 180 top
LCD_HDR  85,55 0 top
MICROSD  106.5,24 270 top
MINIUSB  111.5,42 180 top
NMOS_BLU  94.75,45.5 0 top
NMOS_GRN  89.75,45.5 0 top
NMOS_RED  84.75,45.5 0 top
OBD_HDR  6,30.25 90 top
PDI_HDR  30,55 0 top
PWR_LED  11,4.25 270 top
R_BLU_LED  93.5,49.75 90 top
R_BLU_PD  96,49.75 270 top
R_CAN_HI_LO  16.5,30.25 270 top
R_CAN_INT  35.5,24.75 90 top
R_CAN_RST1  28.75,24.75 270 top
R_CAN_RST2  30,30.75 0 top
R_CAN_SS  33,24.75 270 top
R_FTDI_RX_LED  77.25,29.5 180 top
R_FTDI_TX_LED  77.25,27.25 180 top
R_GRN_LED  88.5,49.75 90 top
R_GRN_PD  91,49.75 270 top
R_LCD_RESET  74.5,56.25 180 top
R_PWR_LED  11,1.75 0 top
R_RED_LED  83.5,49.75 90 top
R_RED_PD  86,49.75 270 top
R_RESET_PU  39.75,49.75 180 top
R_RTC_INT  80.75,23 180 top
R_RTC_SS  80.25,18.25 270 top
R_SD_DETECT  107.75,14.25 180 top
R_SD_SS  96.25,25.75 270 top
R_USB+  99.5,43 0 top
R_USB-  99.5,40.25 0 top
R_VBUS_HIGH  104.75,34 0 top
R_VBUS_LOW  99.5,34 0 top
RTC  76.45,19.1 0 top
RTC_BATT  89.5,12.5 270 top
RTC_XTAL  76.5,14.5 180 top
SW_RESET  40,55 180 top
VR_3V3  6.75,15.5 90 top
VR_5V  9.5,42 270 top

### Tracks (layer width: path | path; a pad name or v marks a point on that pad's centre or on a via)
+3V3  (via drill 0.6)
  Top 0.3: MICROSD.P$4 112.22,22.25 v113.5,22.25 | 9.25,8 4.5,12.75 VR_3V3.P$3 4.96,12.96 5,13 9.5,13 11.75,15.25 L_AVR_PWR.2 | 9.25,8 PWR_LED.A | C_CAN_XC_3V3.1 18.4,33.3 CAN_XCVR.P$5 19.7,32 20.5,32 v21.25,31.25 | BEAD_GPS.1 18,3.25 15,6.25 11,6.25 9.25,8 | CAN_CTRLR.P$20 26.57,22.43 v26.5,22.5 | R_CAN_SS.1 R_CAN_INT.2 | R_CAN_SS.1 31.42,26.17 v31.25,26 | R_CAN_RST2.2 32,30.75 | 32,30.75 33,29.75 R_CAN_SS.1 | 32,30.75 32,43.25 | 32,43.25 32,43.42 36.58,48 | 36.58,48 R_RESET_PU.2 | PDI_HDR.2 27.02,56.27 25.75,55 25.75,49.5 32,43.25 | JTAG_HDR.4 62.46,56.29 60.75,58 53,58 43,48 36.58,48 | FTDI.P$15 82.93,34.93 v83.25,35.25 | v85,38.25 86.6,38.25 C_FTDI_PWR1.1 C_FTDI_PWR2.1 | v106.5,16.5 106.5,14.42 R_SD_DETECT.2 104.25,14.25 103.5,15 99.75,15 97.75,17 97.75,25.75 96.33,27.17 R_SD_SS.1 92.92,30.5 v86,30.5 85,29.5 FTDI_RX_LED.A FTDI_TX_LED.A 84.5,26.25 83,24.75 80.75,24.75 79.33,23.33 R_RTC_INT.2 | R_RTC_INT.2 79,23.33 78.75,23.75 76,23.75 75.45,23.2 RTC.P$10 74.25,22.5 C_RTC_PWR.1 | R_RTC_SS.1 80,19.92 80,21 79.33,21.67 R_RTC_INT.2 | R_LCD_RESET.2 73.08,57.67 v72.75,58 | v87,44.5 87,41.1 C_FTDI_PWR2.1 | NMOS_RED.1 86.98,44.48 v87,44.5 | v87,44.5 87.02,44.48 NMOS_GRN.1 NMOS_BLU.1 | C_FTDI_PWR2.1 86.25,41 85.5,40.25 C_FTDI_PWR3.1
  Bottom 0.3: v21.25,31.25 21.25,27.75 16,22.5 | 16,22.5 6.5,13 5,13 4.96,12.96 VR_3V3.P$3 | 16,22.5 v26.5,22.5 27.75,22.5 v31.25,26 | v83.25,35.25 84.62,36.62 | 84.62,36.62 85,37 v85,38.25 | v86,30.5 86,35.25 84.62,36.62 | v113.5,22.25 108.75,22.25 106.5,20 v106.5,16.5 | JTAG_HDR.4 62.46,56.46 64,58 v72.75,58 82,58 LCD_HDR.6 85,55 87.54,55 LCD_HDR.9 88.81,53.31 88.75,53.25 88.75,51.25 87,49.5 v87,44.5
+5V
  Top 0.3: C_7805_OUT.1 9.48,43.25 VR_5V.1 9.98,43.27 10,43.25 12,43.25 21.88,33.38 | 24.84,31 CAN_XCVR.P$3 24.36,30.89 21.88,33.38 | C_CAN_XC_5V.1 23.35,34.5 23,34.5 21.88,33.38
+12V
  Top 0.6: VR_5V.3 9.48,40.75 C_7805_IN.1
  Bottom 0.6: VR_5V.3 9.77,40.73 14,36.5 14,29 12.75,27.75 12.39,27.75 OBD_HDR.3 12.79,27.71 14,26.5 14,24.25 7.75,18 4.5,18 VR_3V3.P$1
BTN_0  (via drill 0.6)
  Top 0.2: AVR.P$62 52.85,39.4 v51.25,41
  Bottom 0.2: BTN_HDR.1 23.25,55.1 23.25,53.25 21,51 21,50.25 30,41.25 45.75,41.25 46,41 v51.25,41
BTN_1  (via drill 0.6)
  Top 0.2: AVR.P$63 52.05,39.2 51.5,39.75 v50.25,39.75
  Bottom 0.2: BTN_HDR.2 22,53.65 22,53.5 20.5,52 20.5,50 29.75,40.75 45.5,40.75 46.5,39.75 v50.25,39.75
BTN_2  (via drill 0.6)
  Top 0.2: AVR.P$64 v50,38.25
  Bottom 0.2: BTN_HDR.3 19.75,56.06 19.75,56 20.75,55 20.75,53 20,52.25 20,49.75 29.5,40.25 45.25,40.25 47.25,38.25 v50,38.25
BTN_3  (via drill 0.6)
  Top 0.2: v39.5,36.25 AVR.P$1
  Bottom 0.2: BTN_HDR.4 19.5,53.69 19.5,49.5 32.75,36.25 v39.5,36.25
BTN_4  (via drill 0.6)
  Top 0.2: AVR.P$2 47.95,35.45 47.75,35.25 v38.25,35.25
  Bottom 0.2: BTN_HDR.5 17.25,56.02 17.25,56 18.25,55 18.25,52.25 19,51.5 19,49.25 33,35.25 v38.25,35.25
BTN_5  (via drill 0.6)
  Top 0.2: AVR.P$3 47.9,34.65 47.5,34.25 v39.5,34.25
  Bottom 0.2: BTN_HDR.6 17.23,53.5 17.25,53.5 17.25,52.5 18.5,51.25 18.5,49 33.25,34.25 v39.5,34.25
BTN_6  (via drill 0.6)
  Top 0.2: AVR.P$4 48.1,33.85 47.5,33.25 v38.25,33.25
  Bottom 0.2: BTN_HDR.7 14.73,56 14.75,56 15.75,55 15.75,53.25 18,51 18,48.75 33.5,33.25 v38.25,33.25
BTN_7  (via drill 0.6)
  Top 0.2: AVR.P$5 48.3,33.05 47.5,32.25 v39.5,32.25
  Bottom 0.2: BTN_HDR.8 14.69,53.5 14.75,53.5 17.5,50.75 17.5,48.5 33.75,32.25 v39.5,32.25
CAN_HI
  Top 0.2: CAN_XCVR.P$7 19.43,29.5 18.25,29.5 17.75,29 17,29 16.83,28.83 R_CAN_HI_LO.2 16.33,29 13.5,29 12.35,30.15 OBD_HDR.5
CAN_INT
  Top 0.2: AVR.P$8 47.85,30.65 47.5,31 46.25,31 44,28.75 40.5,28.75 39,27.25 39,24.5 38,23.5 35.67,23.5 R_CAN_INT.1 33.92,21.75 31.5,21.75 31.12,21.38 CAN_CTRLR.P$13
CAN_LO
  Top 0.2: CAN_XCVR.P$6 19.43,31 18.25,31 17.75,31.5 17,31.5 16.83,31.67 R_CAN_HI_LO.1 16.33,31.5 11,31.5 9.81,30.31 OBD_HDR.6
CAN_MISO  (1 unrouted)
  Top 0.2: CAN_CTRLR.P$17 28.52,19.23 30.25,17.5
CAN_MOSI  (1 unrouted)
  Top 0.2: CAN_CTRLR.P$16 29.18,19.32 30.5,18
CAN_RX
  Top 0.2: CAN_XCVR.P$4 25.11,32 25.5,32 26.5,31 26.5,26.5 25.5,25.5 25.5,19.5 27.23,17.77 CAN_CTRLR.P$2
CAN_SCK  (1 unrouted)
  Top 0.2: CAN_CTRLR.P$14 30.48,18.77 30.75,18.5
CAN_SS  (via drill 0.6)  (1 unrouted)
  Top 0.2: R_CAN_SS.2 32.42,22.75 31.25,22.75 v31,22.5 30.5,22 28.25,22 27.88,21.62 CAN_CTRLR.P$18
CAN_STANDBY  (via drill 0.6)
  Top 0.2: AVR.P$29 61.05,23.7 v60.75,24 | v24.5,16.5 24.5,22.25 19.75,27 19.75,28.14 CAN_XCVR.P$8
  Bottom 0.2: v60.75,24 60.25,23.5 52,23.5 51.5,23 42.75,23 36.75,17 25,17 v24.5,16.5
CAN_TX
  Top 0.2: CAN_XCVR.P$1 25,28.3 25,19.25 26.57,17.68 CAN_CTRLR.P$1
FTDI_CTS#  (1 unrouted)
FTDI_RTS#  (1 unrouted)
FTDI_RXD  (1 unrouted)
FTDI_TXD  (1 unrouted)
GND  (3 unrouted)
  pour Top (isolate 0.3): 4.25,52 arc90 8.25,56 8.25,60 106.25,60 106.25,56 arc90 110.25,52 114,52 114,8.5 110.25,8.5 arc90 106.25,4.5 106.25,0.5 8.25,0.5 8.25,4.5 arc90 4.25,8.5 0.5,8.5 0.5,52
  pour Bottom (isolate 0.3): 4.25,52 arc90 8.25,56 8.25,60 106.25,60 106.25,56 arc90 110.25,52 114,52 114,8.5 110.25,8.5 arc90 106.25,4.5 106.25,0.5 8.25,0.5 8.25,4.5 arc90 4.25,8.5 0.5,8.5 0.5,52
GPS_1HZ  (via drill 0.6)
  Top 0.2: 58.75,22.15 AVR.P$26 58.65,21.15 v58,20.5 | v56.25,15.75 50,15.75 49.75,16 49.75,17.5 GPS.P$13
  Bottom 0.2: v58,20.5 57,19.5 57,16.5 v56.25,15.75
GPS_RX  (via drill 0.6)
  Top 0.2: 60.25,23.25 AVR.P$28 60.25,20.25 v59.25,19.25 | v58.75,15.75 58,15 58,11.25 52.75,6 52.75,1.6 GPS.P$10
  Bottom 0.2: v59.25,19.25 58,18 58,16.5 v58.75,15.75
GPS_TX  (via drill 0.6)
  Top 0.2: AVR.P$27 59.45,20.7 v58,19.25 | v57.5,15.75 57.5,11.5 52.25,6.25 52.25,4 51.25,3 51.25,1.6 GPS.P$9
  Bottom 0.2: v58,19.25 57.5,18.75 v57.5,15.75
JTAG_TCK  (via drill 0.6)
  Top 0.2: AVR.P$12 46.55,27.45 v46.5,27.5 | v60,49.75 59.25,50.5 49.25,50.5 42.5,43.75 42.5,38 v43.25,37.25
  Bottom 0.2: v46.5,27.5 46,27.5 45,28.5 45,35.5 v43.25,37.25 | v60,49.75 60,53.65 JTAG_HDR.1
JTAG_TDI  (via drill 0.6)
  Top 0.2: AVR.P$11 48,28.25 47.5,28.75 v46.25,28.75 | JTAG_HDR.9 70.08,53.33 70,53.25 70,52.75 66,48.75 59.5,48.75 58.25,50 49.5,50 43,43.5 43,38.75 v44.5,37.25
  Bottom 0.2: v46.25,28.75 45.5,29.5 45.5,36.25 v44.5,37.25
JTAG_TDO  (via drill 0.6)
  Top 0.2: AVR.P$13 45.6,26.65 v45,27.25 | v42,37.25 42,44 49,51 60.25,51 62.5,53.25 62.5,53.69 JTAG_HDR.3
  Bottom 0.2: v45,27.25 44.5,27.75 44.5,34.75 v42,37.25
JTAG_TMS  (via drill 0.6)
  Top 0.2: AVR.P$10 47.95,29.05 v47.25,29.75 | v65,47.5 64.25,48.25 59.25,48.25 58,49.5 49.75,49.5 43.5,43.25 43.5,39.5 v45.75,37.25
  Bottom 0.2: v47.25,29.75 46,31 46,37 v45.75,37.25 | JTAG_HDR.5 v65,47.5
LCD_A0  (via drill 0.6)  (1 unrouted)
  Top 0.2: v79.25,51.75 75,51.75 v73.5,50.25
  Bottom 0.2: LCD_HDR.3 81.19,53.69 v79.25,51.75 | v73.5,50.25 74,49.75 74,47.75
LCD_BL_B-
  Top 0.3: R_BLU_LED.2 93.5,51.75 91.75,53.5 91.58,53.5 LCD_HDR.11
LCD_BL_G-
  Top 0.3: R_GRN_LED.2 88.5,51.25 90,52.75 90,55.25 89.25,56 89.08,56 LCD_HDR.10
LCD_BL_R-
  Top 0.3: R_RED_LED.2 83.5,51.5 85,53 85,55 LCD_HDR.8
LCD_RESET  (via drill 0.6)  (1 unrouted)
  Top 0.2: LCD_HDR.2 75.94,56.27 R_LCD_RESET.1 75.92,55.83 76,55.75 76,55.25 v74.5,53.75
  Bottom 0.2: v74.5,53.75 75,53.25 75,47.75
LCD_SCLK  (via drill 0.6)  (1 unrouted)
  Top 0.2: LCD_HDR.4 81.19,56.19 80,55 77,55 v74,52
  Bottom 0.2: v74,52 74.5,51.5 74.5,47.75
LCD_SID  (via drill 0.6)  (1 unrouted)
  Top 0.2: v81,51.75 80,50.75 75.25,50.75 v73,48.5
  Bottom 0.2: LCD_HDR.5 81.75,51.75 v81,51.75 | v73,48.5 73.5,48 73.5,47.75
N$1
  Top 0.3: BEAD_GPS.2 24.2,3 C_GPS_PWR2.+ 27.5,2.98 27.5,2 28,1.5 38.15,1.5 | GPS.P$1 39.05,1.55 39,1.5 38.15,1.5 | 38.15,1.5 C_GPS_PWR1.1
N$2
  Top 0.2: C_RTC_XTAL1.1 78,14.27 RTC_XTAL.1 77,14.5 75.95,15.55 RTC.P$2
N$3
  Top 0.2: RTC.P$1 75.45,14.72 RTC_XTAL.2 75,14.27 C_RTC_XTAL2.1
N$4
  Top 0.2: FTDI.P$3 76.16,36.84 78.7,34.3 FTDI.P$14 | FTDI.P$13 FTDI.P$14 | FTDI.P$14 85.05,34.3 C_FTDI_FLOAT.1
N$5
  Top 0.2: R_CAN_RST1.1 28.6,26.32 C_CAN_RST.1 28.6,30.73 R_CAN_RST2.1
N$6
  Top 0.2: AVR.P$58 56.05,40.55 57.5,42 AVR_XTAL.1 57.66,42.09 56.85,42.9 C_AVR_XTAL1.1
N$7
  Top 0.2: AVR.P$59 55.25,39.5 52.84,41.91 AVR_XTAL.2 53,42.16 53,42.5 53.65,43.15 C_AVR_XTAL2.1
N$8
  Top 0.2: R_FTDI_RX_LED.1 FTDI_RX_LED.C
N$9
  Top 0.2: FTDI.P$12 79.53,33.03 79.25,32.75 79.25,32 79.5,31.75 90,31.75 95.25,37 95.25,37.42 R_USB-.1
N$10
  Top 0.2: R_USB+.1 97.5,43 94.75,40.25 94.75,37.25 89.75,32.25 82.25,32.25 82.11,32.39 FTDI.P$11
N$11
  Top 0.2: R_FTDI_TX_LED.1 FTDI_TX_LED.C
N$12
  Top 0.2: R_FTDI_TX_LED.2 75.25,27.25 74.25,28.25 74.25,31.55 FTDI.P$10
N$13  (via drill 0.6)
  Top 0.2: R_FTDI_RX_LED.2 75.83,30.33 v77.5,32 | v78.5,36 78.7,36.2 FTDI.P$17
  Bottom 0.2: v77.5,32 77.5,35 v78.5,36
N$14
  Top 0.2: MINIUSB.P$3 105.5,42 104.75,42.75 103.35,42.75 C_USB+.1 101.07,42.85 R_USB+.2
N$15
  Top 0.2: MINIUSB.P$2 105.45,41.2 104.75,40.5 103.35,40.5 C_USB-.1 101.07,40.4 R_USB-.2
N$17
  Top 0.3: MINIUSB.P$1 107.15,40.4 105.25,38.5 105.25,34.92 R_VBUS_HIGH.2
N$18  (via drill 0.6)
  Top 0.2: NMOS_GRN.3 91.48,46.52 v92,46 | AVR.P$37 65.3,27.5 71,27.5 71.5,28 v71.5,31
  Top 0.3: NMOS_GRN.3 90.74,48.07 R_GRN_PD.2
  Bottom 0.2: v92,46 92,44 91.5,43.5 83.25,43.5 82.75,43 81.75,43 81.25,43.5 76.75,43.5 72,38.75 72,35 71.5,34.5 v71.5,31
N$19  (via drill 0.6)
  Top 0.2: NMOS_BLU.3 96.48,46.52 v97,46 | AVR.P$36 65.35,26.75 66.5,26.75 66.75,27 71.25,27 72,27.75 72,29.25 v72.5,29.75
  Top 0.3: NMOS_BLU.3 95.74,48.07 R_BLU_PD.2
  Bottom 0.2: v97,46 97,44 96,43 83.5,43 83,42.5 81.5,42.5 81,43 77,43 72.5,38.5 v72.5,29.75
N$20
  Top 0.2: C_CAN_XTAL1.1 33.1,7.6 33.25,7.75 33.25,9.5 33.75,10 33.75,10.84 CAN_XTAL.2 33.75,11.16 33.75,11.25 32,13 32,13.5 31.77,13.72 CAN_CTRLR.P$9
N$21
  Top 0.2: C_CAN_XTAL2.1 29.9,7.6 29.75,7.75 29.75,9.5 29.25,10 29.25,10.84 CAN_XTAL.1 29.25,11.16 29.25,11.25 31,13 31,13.75 31.12,13.88 CAN_CTRLR.P$8
N$22
  Top 0.2: CAN_CTRLR.P$19 27.23,21.8 R_CAN_RST1.2
N$23  (via drill 0.6)
  Top 0.3: AVR.P$61 53.65,36.65 v53.5,36.5 | BEAD_AVR_ANALOG.1 40.2,30.7 39.5,30 C_AVR_ANALOG_LOCAL.+
  Bottom 0.3: v53.5,36.5 C_AVR_ANALOG.1 50.1,34.4 46.25,38.25 41.75,38.25 41,37.5 41,32.5 38.52,30.02 C_AVR_ANALOG_LOCAL.+
N$24
  Top 0.3: PWR_LED.C 12.75,2.25 12.42,1.92 R_PWR_LED.2
N$27  (via drill 0.6)
  Top 0.2: NMOS_RED.3 85.74,45.99 85.25,45.5 84.25,45.5 82.75,44 v82.25,44 | AVR.P$38 66.5,28.25 66.75,28 70.75,28 71,28.25 71,30 70.5,30.5 v70.5,32.25
  Top 0.3: NMOS_RED.3 85.74,48.07 R_RED_PD.2
  Bottom 0.2: v70.5,32.25 70.5,34.25 71.5,35.25 71.5,39 76.5,44 v82.25,44
N$28  (via drill 0.6)
  Top 0.3: C_AVR_PWR.+ 20.48,15.25 L_AVR_PWR.1 | AVR.P$53 60.05,36.45 v60.25,36.25 | AVR.P$45 63.6,33.85 v63.25,33.5 | BEAD_AVR_ANALOG.2 42.5,25.75 v43.25,25 43.3,25.05 AVR.P$15 50.2,25.05 v51,24.25 | AVR.P$35 64.15,25.85 v63.5,26.5 | AVR.P$25 57.85,24.4 v57.75,24.5
  Bottom 0.3: 62.15,32.5 C16.1 C15.1 62.25,29.4 62.25,27.75 | 62.15,32.5 C17.1 60.25,34.6 v60.25,36.25 | v63.25,33.5 62.25,32.5 62.15,32.5 | C_AVR_PWR.+ 22.98,17.75 36,17.75 v43.25,25 | v51,24.25 51.65,24.25 C18.1 C14.1 56.85,24.5 v57.75,24.5 57.75,27.25 58.25,27.75 62.25,27.75 | v63.5,26.5 62.25,27.75
N$29
  Top 0.3: NMOS_BLU.2 93.81,48.02 R_BLU_LED.1
N$30
  Top 0.3: NMOS_GRN.2 88.81,48.02 R_GRN_LED.1
N$31
  Top 0.3: NMOS_RED.2 83.81,48.02 R_RED_LED.1
PDI_DATA  (via drill 0.6)
  Top 0.2: v59.25,41 57.65,39.4 AVR.P$56
  Bottom 0.2: PDI_HDR.1 27.46,53.29 27.5,53.25 27.5,52.75 28.5,51.75 54.5,51.75 59.25,47 v59.25,41
RESET  (via drill 0.6)
  Top 0.2: 41.17,50.42 R_RESET_PU.1 v43.25,49.75 43.75,49.75 52.75,58.75 62.25,58.75 64.73,56.27 JTAG_HDR.6 | 41.17,50.42 42.5,51.75 42.5,53.05 SW_RESET.1 | 41.17,50.42 40.58,50.42 39.75,51.25 35,51.25 33,53.25 33,53.27 PDI_HDR.5 | v57.5,40.5 56.85,39.85 AVR.P$57
  Bottom 0.2: v43.25,49.75 49.25,43.75 53.5,43.75 56.75,40.5 v57.5,40.5
RTC_INT  (via drill 0.6)
  Top 0.2: R_RTC_INT.1 82,22.83 v82,21.25 | v76.5,22.75 75.95,22.2 RTC.P$9 | v75,24.25 73.75,25.5 73.75,30.75 69,35.5 65.3,35.5 AVR.P$47
  Bottom 0.2: v82,21.25 80.75,21.25 79.25,22.75 v76.5,22.75 v75,24.25
RTC_MISO
  Top 0.2: RTC.P$7 76.95,20.2 76.5,19.75 72.5,19.75 70.5,17.75 57.25,17.75 56.5,18.5 56.5,20 55.45,21.05 AVR.P$22
RTC_MOSI
  Top 0.2: RTC.P$6 77.45,19.95 76.75,19.25 72.75,19.25 70.75,17.25 57,17.25 56,18.25 56,19.75 54.65,21.1 AVR.P$21
RTC_SCK
  Top 0.2: RTC.P$8 76.45,20.45 76.25,20.25 72.25,20.25 70.25,18.25 57.5,18.25 57,18.75 57,20.25 56.25,21 AVR.P$23
RTC_SS
  Top 0.2: R_RTC_SS.2 80.17,16.83 78.5,18.5 77.5,18.5 76.95,17.95 | RTC.P$4 76.95,17.95 | 76.95,17.95 76.95,18.05 76.25,18.75 73,18.75 71,16.75 56.75,16.75 55.5,18 55.5,19.5 53.85,21.15 AVR.P$20
SD_DAT1  (1 unrouted)
  Top 0.2: MICROSD.P$8 113,26.75 113.5,27.25
SD_DAT2  (1 unrouted)
  Top 0.2: MICROSD.P$1 112.17,19 113,19 113.5,18.5
SD_DETECT  (1 unrouted)
  Top 0.2: MICROSD.P$9 109.5,14.58 R_SD_DETECT.1
SD_MISO  (1 unrouted)
  Top 0.2: MICROSD.P$7 112.22,25.75 113.25,25.75 113.5,26
SD_MOSI  (1 unrouted)
  Top 0.2: MICROSD.P$3 113.25,21.25 113.5,21
SD_SCK  (1 unrouted)
  Top 0.2: MICROSD.P$5 112.17,23.5 113.5,23.5
SD_SS  (2 unrouted)
  Top 0.2: MICROSD.P$2 112.28,20 113.25,20 113.5,19.75
VBACKUP  (via drill 0.6)
  Top 0.2: RTC_BATT.P$1 89.5,16.5 | C_GPS_BATT.+ 98.5,3.5 95.5,6.5 90.25,6.5 v89.5,7.25 89.5,16.5 | RTC.P$3 76.45,16.05 77,15.5 88.5,15.5 89.5,16.5 | GPS.P$4 43.75,1.6 v43.75,3.5
  Bottom 0.2: v43.75,3.5 46,1.25 88.75,1.25 89.5,2 v89.5,7.25
VBUS_SENSE  (via drill 0.6)
  Top 0.2: R_VBUS_HIGH.1 102,34 | 102,34 R_VBUS_LOW.2 | FTDI.P$18 82.16,36.84 82.25,36.75 v86.5,36.75 | v102,35.75 102,34
  Bottom 0.2: v86.5,36.75 101,36.75 v102,35.75

### Text on the board
Top: TODO: GND plane stitch vias